# Altium project Elkapod_power_supply_controller_module.PrjPcb (part 4 of 5)
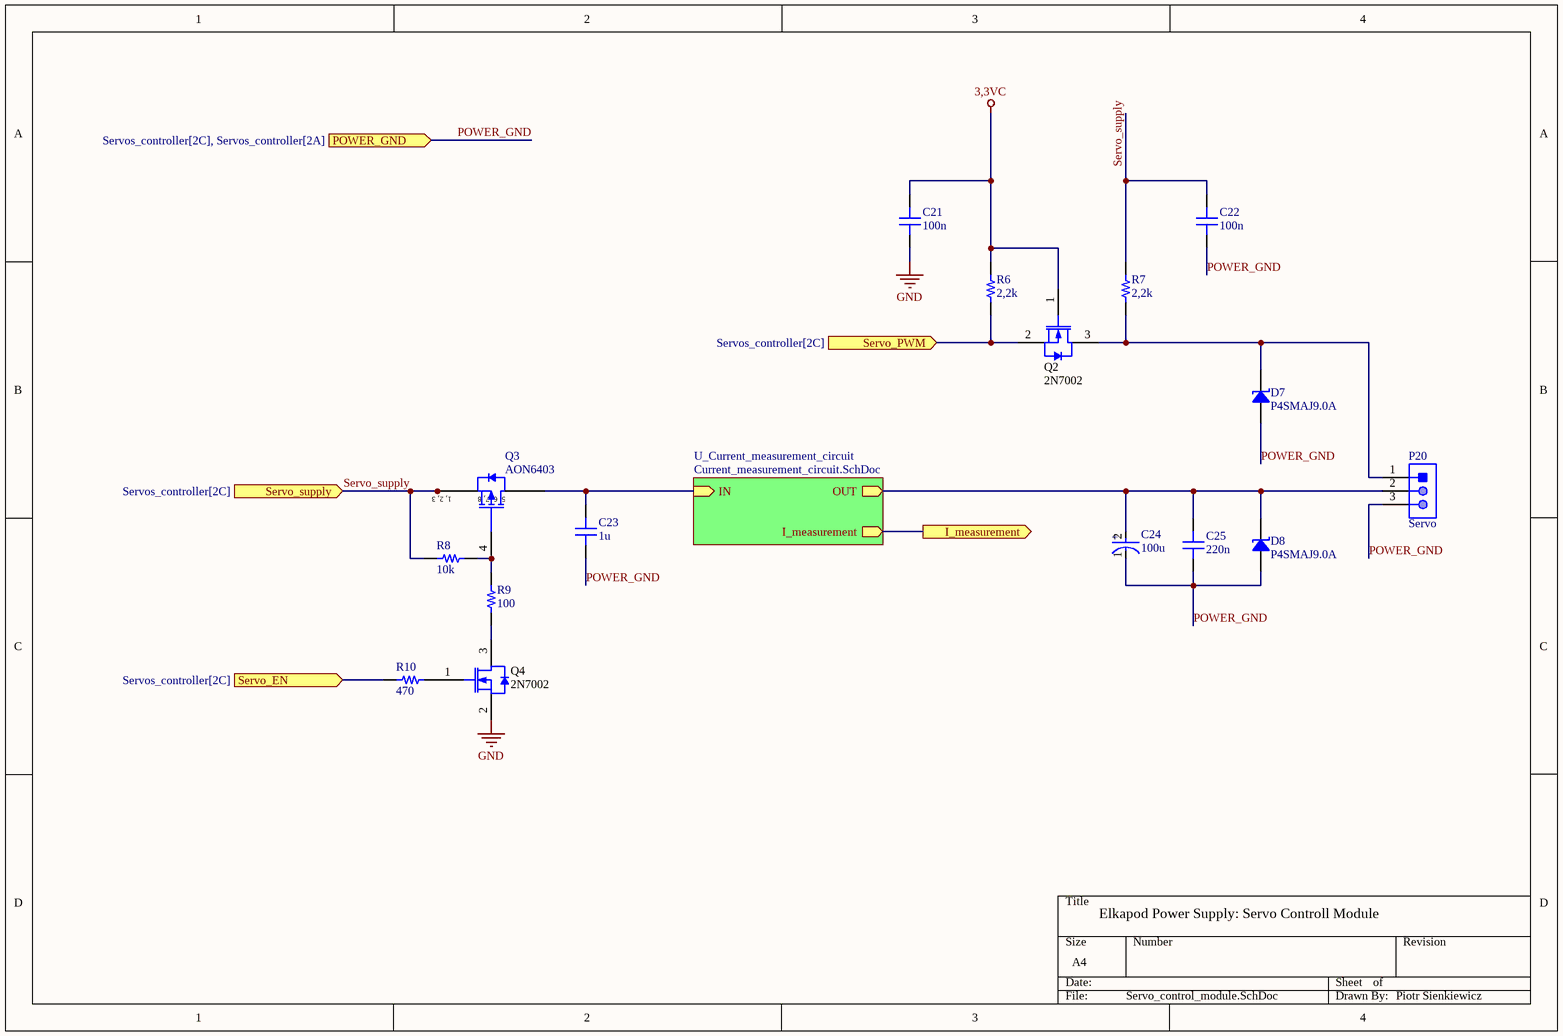
[diagram p8: Servo_control_module.SchDoc]
## Nets that join several sheets
3,3V_STANDBY: Elkapod_power_supply_controller_module (11 pins), Logic_controller (44 pins)
3,3VC: Elkapod_power_supply_controller_module (C17.2 C18.2 C19.2 Q1.5), U_Current_measurement_circuit (C66_U_Current_measurement_circuit#1.2 U8_U_Current_measurement_circuit#1.3), U_Current_measurement_circuit (C66_U_Current_measurement_circuit#2.2 U8_U_Current_measurement_circuit#2.3), U_Current_measurement_circuit (C66_U_Current_measurement_circuit#3.2 U8_U_Current_measurement_circuit#3.3), U_Current_measurement_circuit (C66_U_Current_measurement_circuit#4.2 U8_U_Current_measurement_circuit#4.3), Logic_controller (12 pins), U_Servos_controller/U_Servo_control_module (C21_U_Servos_controller_U_Servo_control_module#1.2 Q2_U_Servos_controller_U_Servo_control_module#1.1 R6_U_Servos_controller_U_Servo_control_module#1.2), U_Servos_controller/U_Servo_control_module/U_Current_measurement_circuit (C66_U_Servos_controller_U_Servo_control_module_U_Current_measurement_circuit#1.2 U8_U_Servos_controller_U_Servo_control_module_U_Current_measurement_circuit#1.3), U_Servos_controller/U_Servo_control_module (C21_U_Servos_controller_U_Servo_control_module#2.2 Q2_U_Servos_controller_U_Servo_control_module#2.1 R6_U_Servos_controller_U_Servo_control_module#2.2), U_Servos_controller/U_Servo_control_module/U_Current_measurement_circuit (C66_U_Servos_controller_U_Servo_control_module_U_Current_measurement_circuit#2.2 U8_U_Servos_controller_U_Servo_control_module_U_Current_measurement_circuit#2.3), U_Servos_controller/U_Servo_control_module (C21_U_Servos_controller_U_Servo_control_module#3.2 Q2_U_Servos_controller_U_Servo_control_module#3.1 R6_U_Servos_controller_U_Servo_control_module#3.2), U_Servos_controller/U_Servo_control_module/U_Current_measurement_circuit (C66_U_Servos_controller_U_Servo_control_module_U_Current_measurement_circuit#3.2 U8_U_Servos_controller_U_Servo_control_module_U_Current_measurement_circuit#3.3), U_Servos_controller/U_Servo_control_module (C21_U_Servos_controller_U_Servo_control_module#4.2 Q2_U_Servos_controller_U_Servo_control_module#4.1 R6_U_Servos_controller_U_Servo_control_module#4.2), U_Servos_controller/U_Servo_control_module/U_Current_measurement_circuit (C66_U_Servos_controller_U_Servo_control_module_U_Current_measurement_circuit#4.2 U8_U_Servos_controller_U_Servo_control_module_U_Current_measurement_circuit#4.3), U_Servos_controller/U_Servo_control_module (C21_U_Servos_controller_U_Servo_control_module#5.2 Q2_U_Servos_controller_U_Servo_control_module#5.1 R6_U_Servos_controller_U_Servo_control_module#5.2), U_Servos_controller/U_Servo_control_module/U_Current_measurement_circuit (C66_U_Servos_controller_U_Servo_control_module_U_Current_measurement_circuit#5.2 U8_U_Servos_controller_U_Servo_control_module_U_Current_measurement_circuit#5.3), U_Servos_controller/U_Servo_control_module (C21_U_Servos_controller_U_Servo_control_module#6.2 Q2_U_Servos_controller_U_Servo_control_module#6.1 R6_U_Servos_controller_U_Servo_control_module#6.2), U_Servos_controller/U_Servo_control_module/U_Current_measurement_circuit (C66_U_Servos_controller_U_Servo_control_module_U_Current_measurement_circuit#6.2 U8_U_Servos_controller_U_Servo_control_module_U_Current_measurement_circuit#6.3), U_Servos_controller/U_Servo_control_module (C21_U_Servos_controller_U_Servo_control_module#7.2 Q2_U_Servos_controller_U_Servo_control_module#7.1 R6_U_Servos_controller_U_Servo_control_module#7.2), U_Servos_controller/U_Servo_control_module/U_Current_measurement_circuit (C66_U_Servos_controller_U_Servo_control_module_U_Current_measurement_circuit#7.2 U8_U_Servos_controller_U_Servo_control_module_U_Current_measurement_circuit#7.3), U_Servos_controller/U_Servo_control_module (C21_U_Servos_controller_U_Servo_control_module#8.2 Q2_U_Servos_controller_U_Servo_control_module#8.1 R6_U_Servos_controller_U_Servo_control_module#8.2), U_Servos_controller/U_Servo_control_module/U_Current_measurement_circuit (C66_U_Servos_controller_U_Servo_control_module_U_Current_measurement_circuit#8.2 U8_U_Servos_controller_U_Servo_control_module_U_Current_measurement_circuit#8.3), U_Servos_controller/U_Servo_control_module (C21_U_Servos_controller_U_Servo_control_module#9.2 Q2_U_Servos_controller_U_Servo_control_module#9.1 R6_U_Servos_controller_U_Servo_control_module#9.2), U_Servos_controller/U_Servo_control_module/U_Current_measurement_circuit (C66_U_Servos_controller_U_Servo_control_module_U_Current_measurement_circuit#9.2 U8_U_Servos_controller_U_Servo_control_module_U_Current_measurement_circuit#9.3), U_Servos_controller/U_Servo_control_module (C21_U_Servos_controller_U_Servo_control_module#10.2 Q2_U_Servos_controller_U_Servo_control_module#10.1 R6_U_Servos_controller_U_Servo_control_module#10.2), U_Servos_controller/U_Servo_control_module/U_Current_measurement_circuit (C66_U_Servos_controller_U_Servo_control_module_U_Current_measurement_circuit#10.2 U8_U_Servos_controller_U_Servo_control_module_U_Current_measurement_circuit#10.3), U_Servos_controller/U_Servo_control_module (C21_U_Servos_controller_U_Servo_control_module#11.2 Q2_U_Servos_controller_U_Servo_control_module#11.1 R6_U_Servos_controller_U_Servo_control_module#11.2), U_Servos_controller/U_Servo_control_module/U_Current_measurement_circuit (C66_U_Servos_controller_U_Servo_control_module_U_Current_measurement_circuit#11.2 U8_U_Servos_controller_U_Servo_control_module_U_Current_measurement_circuit#11.3), U_Servos_controller/U_Servo_control_module (C21_U_Servos_controller_U_Servo_control_module#12.2 Q2_U_Servos_controller_U_Servo_control_module#12.1 R6_U_Servos_controller_U_Servo_control_module#12.2), U_Servos_controller/U_Servo_control_module/U_Current_measurement_circuit (C66_U_Servos_controller_U_Servo_control_module_U_Current_measurement_circuit#12.2 U8_U_Servos_controller_U_Servo_control_module_U_Current_measurement_circuit#12.3), U_Servos_controller/U_Servo_control_module (C21_U_Servos_controller_U_Servo_control_module#13.2 Q2_U_Servos_controller_U_Servo_control_module#13.1 R6_U_Servos_controller_U_Servo_control_module#13.2), U_Servos_controller/U_Servo_control_module/U_Current_measurement_circuit (C66_U_Servos_controller_U_Servo_control_module_U_Current_measurement_circuit#13.2 U8_U_Servos_controller_U_Servo_control_module_U_Current_measurement_circuit#13.3), U_Servos_controller/U_Servo_control_module (C21_U_Servos_controller_U_Servo_control_module#14.2 Q2_U_Servos_controller_U_Servo_control_module#14.1 R6_U_Servos_controller_U_Servo_control_module#14.2), U_Servos_controller/U_Servo_control_module/U_Current_measurement_circuit (C66_U_Servos_controller_U_Servo_control_module_U_Current_measurement_circuit#14.2 U8_U_Servos_controller_U_Servo_control_module_U_Current_measurement_circuit#14.3), U_Servos_controller/U_Servo_control_module (C21_U_Servos_controller_U_Servo_control_module#15.2 Q2_U_Servos_controller_U_Servo_control_module#15.1 R6_U_Servos_controller_U_Servo_control_module#15.2), U_Servos_controller/U_Servo_control_module/U_Current_measurement_circuit (C66_U_Servos_controller_U_Servo_control_module_U_Current_measurement_circuit#15.2 U8_U_Servos_controller_U_Servo_control_module_U_Current_measurement_circuit#15.3), U_Servos_controller/U_Servo_control_module (C21_U_Servos_controller_U_Servo_control_module#16.2 Q2_U_Servos_controller_U_Servo_control_module#16.1 R6_U_Servos_controller_U_Servo_control_module#16.2), U_Servos_controller/U_Servo_control_module/U_Current_measurement_circuit (C66_U_Servos_controller_U_Servo_control_module_U_Current_measurement_circuit#16.2 U8_U_Servos_controller_U_Servo_control_module_U_Current_measurement_circuit#16.3), U_Servos_controller/U_Servo_control_module (C21_U_Servos_controller_U_Servo_control_module#17.2 Q2_U_Servos_controller_U_Servo_control_module#17.1 R6_U_Servos_controller_U_Servo_control_module#17.2), U_Servos_controller/U_Servo_control_module/U_Current_measurement_circuit (C66_U_Servos_controller_U_Servo_control_module_U_Current_measurement_circuit#17.2 U8_U_Servos_controller_U_Servo_control_module_U_Current_measurement_circuit#17.3), U_Servos_controller/U_Servo_control_module (C21_U_Servos_controller_U_Servo_control_module#18.2 Q2_U_Servos_controller_U_Servo_control_module#18.1 R6_U_Servos_controller_U_Servo_control_module#18.2), U_Servos_controller/U_Servo_control_module/U_Current_measurement_circuit (C66_U_Servos_controller_U_Servo_control_module_U_Current_measurement_circuit#18.2 U8_U_Servos_controller_U_Servo_control_module_U_Current_measurement_circuit#18.3)
5V_STANDBY: Elkapod_power_supply_controller_module (5 pins), U_Current_measurement_circuit (R80_U_Current_measurement_circuit#4.1 U8_U_Current_measurement_circuit#4.5), Logic_controller (FB2.1 IC1.2 R28.1)
AGND: Elkapod_power_supply_controller_module (R1.1), U_Current_measurement_circuit (C65_U_Current_measurement_circuit#1.1 C66_U_Current_measurement_circuit#1.1 U8_U_Current_measurement_circuit#1.1 U8_U_Current_measurement_circuit#1.2), U_Current_measurement_circuit (C65_U_Current_measurement_circuit#2.1 C66_U_Current_measurement_circuit#2.1 U8_U_Current_measurement_circuit#2.1 U8_U_Current_measurement_circuit#2.2), U_Current_measurement_circuit (C65_U_Current_measurement_circuit#3.1 C66_U_Current_measurement_circuit#3.1 U8_U_Current_measurement_circuit#3.1 U8_U_Current_measurement_circuit#3.2), U_Current_measurement_circuit (C65_U_Current_measurement_circuit#4.1 C66_U_Current_measurement_circuit#4.1 U8_U_Current_measurement_circuit#4.1 U8_U_Current_measurement_circuit#4.2), Logic_controller (6 pins), U_Servos_controller/U_Servo_control_module/U_Current_measurement_circuit (C65_U_Servos_controller_U_Servo_control_module_U_Current_measurement_circuit#1.1 C66_U_Servos_controller_U_Servo_control_module_U_Current_measurement_circuit#1.1 U8_U_Servos_controller_U_Servo_control_module_U_Current_measurement_circuit#1.1 U8_U_Servos_controller_U_Servo_control_module_U_Current_measurement_circuit#1.2), U_Servos_controller/U_Servo_control_module/U_Current_measurement_circuit (C65_U_Servos_controller_U_Servo_control_module_U_Current_measurement_circuit#2.1 C66_U_Servos_controller_U_Servo_control_module_U_Current_measurement_circuit#2.1 U8_U_Servos_controller_U_Servo_control_module_U_Current_measurement_circuit#2.1 U8_U_Servos_controller_U_Servo_control_module_U_Current_measurement_circuit#2.2), U_Servos_controller/U_Servo_control_module/U_Current_measurement_circuit (C65_U_Servos_controller_U_Servo_control_module_U_Current_measurement_circuit#3.1 C66_U_Servos_controller_U_Servo_control_module_U_Current_measurement_circuit#3.1 U8_U_Servos_controller_U_Servo_control_module_U_Current_measurement_circuit#3.1 U8_U_Servos_controller_U_Servo_control_module_U_Current_measurement_circuit#3.2), U_Servos_controller/U_Servo_control_module/U_Current_measurement_circuit (C65_U_Servos_controller_U_Servo_control_module_U_Current_measurement_circuit#4.1 C66_U_Servos_controller_U_Servo_control_module_U_Current_measurement_circuit#4.1 U8_U_Servos_controller_U_Servo_control_module_U_Current_measurement_circuit#4.1 U8_U_Servos_controller_U_Servo_control_module_U_Current_measurement_circuit#4.2), U_Servos_controller/U_Servo_control_module/U_Current_measurement_circuit (C65_U_Servos_controller_U_Servo_control_module_U_Current_measurement_circuit#5.1 C66_U_Servos_controller_U_Servo_control_module_U_Current_measurement_circuit#5.1 U8_U_Servos_controller_U_Servo_control_module_U_Current_measurement_circuit#5.1 U8_U_Servos_controller_U_Servo_control_module_U_Current_measurement_circuit#5.2), U_Servos_controller/U_Servo_control_module/U_Current_measurement_circuit (C65_U_Servos_controller_U_Servo_control_module_U_Current_measurement_circuit#6.1 C66_U_Servos_controller_U_Servo_control_module_U_Current_measurement_circuit#6.1 U8_U_Servos_controller_U_Servo_control_module_U_Current_measurement_circuit#6.1 U8_U_Servos_controller_U_Servo_control_module_U_Current_measurement_circuit#6.2), U_Servos_controller/U_Servo_control_module/U_Current_measurement_circuit (C65_U_Servos_controller_U_Servo_control_module_U_Current_measurement_circuit#7.1 C66_U_Servos_controller_U_Servo_control_module_U_Current_measurement_circuit#7.1 U8_U_Servos_controller_U_Servo_control_module_U_Current_measurement_circuit#7.1 U8_U_Servos_controller_U_Servo_control_module_U_Current_measurement_circuit#7.2), U_Servos_controller/U_Servo_control_module/U_Current_measurement_circuit (C65_U_Servos_controller_U_Servo_control_module_U_Current_measurement_circuit#8.1 C66_U_Servos_controller_U_Servo_control_module_U_Current_measurement_circuit#8.1 U8_U_Servos_controller_U_Servo_control_module_U_Current_measurement_circuit#8.1 U8_U_Servos_controller_U_Servo_control_module_U_Current_measurement_circuit#8.2), U_Servos_controller/U_Servo_control_module/U_Current_measurement_circuit (C65_U_Servos_controller_U_Servo_control_module_U_Current_measurement_circuit#9.1 C66_U_Servos_controller_U_Servo_control_module_U_Current_measurement_circuit#9.1 U8_U_Servos_controller_U_Servo_control_module_U_Current_measurement_circuit#9.1 U8_U_Servos_controller_U_Servo_control_module_U_Current_measurement_circuit#9.2), U_Servos_controller/U_Servo_control_module/U_Current_measurement_circuit (C65_U_Servos_controller_U_Servo_control_module_U_Current_measurement_circuit#10.1 C66_U_Servos_controller_U_Servo_control_module_U_Current_measurement_circuit#10.1 U8_U_Servos_controller_U_Servo_control_module_U_Current_measurement_circuit#10.1 U8_U_Servos_controller_U_Servo_control_module_U_Current_measurement_circuit#10.2), U_Servos_controller/U_Servo_control_module/U_Current_measurement_circuit (C65_U_Servos_controller_U_Servo_control_module_U_Current_measurement_circuit#11.1 C66_U_Servos_controller_U_Servo_control_module_U_Current_measurement_circuit#11.1 U8_U_Servos_controller_U_Servo_control_module_U_Current_measurement_circuit#11.1 U8_U_Servos_controller_U_Servo_control_module_U_Current_measurement_circuit#11.2), U_Servos_controller/U_Servo_control_module/U_Current_measurement_circuit (C65_U_Servos_controller_U_Servo_control_module_U_Current_measurement_circuit#12.1 C66_U_Servos_controller_U_Servo_control_module_U_Current_measurement_circuit#12.1 U8_U_Servos_controller_U_Servo_control_module_U_Current_measurement_circuit#12.1 U8_U_Servos_controller_U_Servo_control_module_U_Current_measurement_circuit#12.2), U_Servos_controller/U_Servo_control_module/U_Current_measurement_circuit (C65_U_Servos_controller_U_Servo_control_module_U_Current_measurement_circuit#13.1 C66_U_Servos_controller_U_Servo_control_module_U_Current_measurement_circuit#13.1 U8_U_Servos_controller_U_Servo_control_module_U_Current_measurement_circuit#13.1 U8_U_Servos_controller_U_Servo_control_module_U_Current_measurement_circuit#13.2), U_Servos_controller/U_Servo_control_module/U_Current_measurement_circuit (C65_U_Servos_controller_U_Servo_control_module_U_Current_measurement_circuit#14.1 C66_U_Servos_controller_U_Servo_control_module_U_Current_measurement_circuit#14.1 U8_U_Servos_controller_U_Servo_control_module_U_Current_measurement_circuit#14.1 U8_U_Servos_controller_U_Servo_control_module_U_Current_measurement_circuit#14.2), U_Servos_controller/U_Servo_control_module/U_Current_measurement_circuit (C65_U_Servos_controller_U_Servo_control_module_U_Current_measurement_circuit#15.1 C66_U_Servos_controller_U_Servo_control_module_U_Current_measurement_circuit#15.1 U8_U_Servos_controller_U_Servo_control_module_U_Current_measurement_circuit#15.1 U8_U_Servos_controller_U_Servo_control_module_U_Current_measurement_circuit#15.2), U_Servos_controller/U_Servo_control_module/U_Current_measurement_circuit (C65_U_Servos_controller_U_Servo_control_module_U_Current_measurement_circuit#16.1 C66_U_Servos_controller_U_Servo_control_module_U_Current_measurement_circuit#16.1 U8_U_Servos_controller_U_Servo_control_module_U_Current_measurement_circuit#16.1 U8_U_Servos_controller_U_Servo_control_module_U_Current_measurement_circuit#16.2), U_Servos_controller/U_Servo_control_module/U_Current_measurement_circuit (C65_U_Servos_controller_U_Servo_control_module_U_Current_measurement_circuit#17.1 C66_U_Servos_controller_U_Servo_control_module_U_Current_measurement_circuit#17.1 U8_U_Servos_controller_U_Servo_control_module_U_Current_measurement_circuit#17.1 U8_U_Servos_controller_U_Servo_control_module_U_Current_measurement_circuit#17.2), U_Servos_controller/U_Servo_control_module/U_Current_measurement_circuit (C65_U_Servos_controller_U_Servo_control_module_U_Current_measurement_circuit#18.1 C66_U_Servos_controller_U_Servo_control_module_U_Current_measurement_circuit#18.1 U8_U_Servos_controller_U_Servo_control_module_U_Current_measurement_circuit#18.1 U8_U_Servos_controller_U_Servo_control_module_U_Current_measurement_circuit#18.2)
GND: Elkapod_power_supply_controller_module (24 pins), Controllable_voltage_outputs (R60.2), Logic_controller (89 pins), U_Servos_controller (R11_U_Servos_controller#1.1), U_Servos_controller/U_Servo_control_module (C21_U_Servos_controller_U_Servo_control_module#1.1 Q4_U_Servos_controller_U_Servo_control_module#1.2), U_Servos_controller/U_Servo_control_module (C21_U_Servos_controller_U_Servo_control_module#2.1 Q4_U_Servos_controller_U_Servo_control_module#2.2), U_Servos_controller/U_Servo_control_module (C21_U_Servos_controller_U_Servo_control_module#3.1 Q4_U_Servos_controller_U_Servo_control_module#3.2), U_Servos_controller/U_Servo_control_module (C21_U_Servos_controller_U_Servo_control_module#4.1 Q4_U_Servos_controller_U_Servo_control_module#4.2), U_Servos_controller/U_Servo_control_module (C21_U_Servos_controller_U_Servo_control_module#5.1 Q4_U_Servos_controller_U_Servo_control_module#5.2), U_Servos_controller/U_Servo_control_module (C21_U_Servos_controller_U_Servo_control_module#6.1 Q4_U_Servos_controller_U_Servo_control_module#6.2), U_Servos_controller (R11_U_Servos_controller#2.1), U_Servos_controller/U_Servo_control_module (C21_U_Servos_controller_U_Servo_control_module#7.1 Q4_U_Servos_controller_U_Servo_control_module#7.2), U_Servos_controller/U_Servo_control_module (C21_U_Servos_controller_U_Servo_control_module#8.1 Q4_U_Servos_controller_U_Servo_control_module#8.2), U_Servos_controller/U_Servo_control_module (C21_U_Servos_controller_U_Servo_control_module#9.1 Q4_U_Servos_controller_U_Servo_control_module#9.2), U_Servos_controller/U_Servo_control_module (C21_U_Servos_controller_U_Servo_control_module#10.1 Q4_U_Servos_controller_U_Servo_control_module#10.2), U_Servos_controller/U_Servo_control_module (C21_U_Servos_controller_U_Servo_control_module#11.1 Q4_U_Servos_controller_U_Servo_control_module#11.2), U_Servos_controller/U_Servo_control_module (C21_U_Servos_controller_U_Servo_control_module#12.1 Q4_U_Servos_controller_U_Servo_control_module#12.2), U_Servos_controller (R11_U_Servos_controller#3.1), U_Servos_controller/U_Servo_control_module (C21_U_Servos_controller_U_Servo_control_module#13.1 Q4_U_Servos_controller_U_Servo_control_module#13.2), U_Servos_controller/U_Servo_control_module (C21_U_Servos_controller_U_Servo_control_module#14.1 Q4_U_Servos_controller_U_Servo_control_module#14.2), U_Servos_controller/U_Servo_control_module (C21_U_Servos_controller_U_Servo_control_module#15.1 Q4_U_Servos_controller_U_Servo_control_module#15.2), U_Servos_controller/U_Servo_control_module (C21_U_Servos_controller_U_Servo_control_module#16.1 Q4_U_Servos_controller_U_Servo_control_module#16.2), U_Servos_controller/U_Servo_control_module (C21_U_Servos_controller_U_Servo_control_module#17.1 Q4_U_Servos_controller_U_Servo_control_module#17.2), U_Servos_controller/U_Servo_control_module (C21_U_Servos_controller_U_Servo_control_module#18.1 Q4_U_Servos_controller_U_Servo_control_module#18.2)
GND_3V3_2: Elkapod_power_supply_controller_module (P18.2), Controllable_voltage_outputs (10 pins)
GND_5V: Elkapod_power_supply_controller_module (16 pins), Controllable_voltage_outputs (17 pins)
POWER_GND: Elkapod_power_supply_controller_module (P19.2), U_Servos_controller (R11_U_Servos_controller#1.2), U_Servos_controller/U_Servo_control_module (7 pins), U_Servos_controller/U_Servo_control_module (7 pins), U_Servos_controller/U_Servo_control_module (7 pins), U_Servos_controller/U_Servo_control_module (7 pins), U_Servos_controller/U_Servo_control_module (7 pins), U_Servos_controller/U_Servo_control_module (7 pins)
POWER_GND: Elkapod_power_supply_controller_module (P16.2), U_Servos_controller (R11_U_Servos_controller#2.2), U_Servos_controller/U_Servo_control_module (7 pins), U_Servos_controller/U_Servo_control_module (7 pins), U_Servos_controller/U_Servo_control_module (7 pins), U_Servos_controller/U_Servo_control_module (7 pins), U_Servos_controller/U_Servo_control_module (7 pins), U_Servos_controller/U_Servo_control_module (7 pins)
POWER_GND: Elkapod_power_supply_controller_module (P17.2), U_Servos_controller (R11_U_Servos_controller#3.2), U_Servos_controller/U_Servo_control_module (7 pins), U_Servos_controller/U_Servo_control_module (7 pins), U_Servos_controller/U_Servo_control_module (7 pins), U_Servos_controller/U_Servo_control_module (7 pins), U_Servos_controller/U_Servo_control_module (7 pins), U_Servos_controller/U_Servo_control_module (7 pins)
3,3V: Elkapod_power_supply_controller_module (P18.1), Controllable_voltage_outputs (12 pins)
5V: Elkapod_power_supply_controller_module (C14.2 P6.1 P12.1), U_Current_measurement_circuit (R80_U_Current_measurement_circuit#3.2 U8_U_Current_measurement_circuit#3.4), Controllable_voltage_outputs (12 pins)
5V_POWER_OUT: Elkapod_power_supply_controller_module (5 pins), U_Current_measurement_circuit (R80_U_Current_measurement_circuit#3.1 U8_U_Current_measurement_circuit#3.5)
5V_STANDBY_IN: Elkapod_power_supply_controller_module (CN1.1 CN1.2 CN1.3 CN1.4), U_Current_measurement_circuit (R80_U_Current_measurement_circuit#4.2 U8_U_Current_measurement_circuit#4.4)
I_3V3_POW_SENSE: U_Current_measurement_circuit (C65_U_Current_measurement_circuit#2.2 R81_U_Current_measurement_circuit#2.2), Logic_controller (U3.18)
I_5V_POW_SENSE: U_Current_measurement_circuit (C65_U_Current_measurement_circuit#3.2 R81_U_Current_measurement_circuit#3.2), Logic_controller (U3.15)
I_MANIP_SENSE: U_Current_measurement_circuit (C65_U_Current_measurement_circuit#1.2 R81_U_Current_measurement_circuit#1.2), Logic_controller (U3.14)
I_SERVO1: Logic_controller (U3.21), U_Servos_controller/U_Servo_control_module/U_Current_measurement_circuit (C65_U_Servos_controller_U_Servo_control_module_U_Current_measurement_circuit#7.2 R81_U_Servos_controller_U_Servo_control_module_U_Current_measurement_circuit#7.2)
I_SERVO2: Logic_controller (U3.22), U_Servos_controller/U_Servo_control_module/U_Current_measurement_circuit (C65_U_Servos_controller_U_Servo_control_module_U_Current_measurement_circuit#8.2 R81_U_Servos_controller_U_Servo_control_module_U_Current_measurement_circuit#8.2)
I_SERVO3: Logic_controller (U3.26), U_Servos_controller/U_Servo_control_module/U_Current_measurement_circuit (C65_U_Servos_controller_U_Servo_control_module_U_Current_measurement_circuit#9.2 R81_U_Servos_controller_U_Servo_control_module_U_Current_measurement_circuit#9.2)
I_SERVO4: Logic_controller (U3.27), U_Servos_controller/U_Servo_control_module/U_Current_measurement_circuit (C65_U_Servos_controller_U_Servo_control_module_U_Current_measurement_circuit#10.2 R81_U_Servos_controller_U_Servo_control_module_U_Current_measurement_circuit#10.2)
I_SERVO5: Logic_controller (U3.28), U_Servos_controller/U_Servo_control_module/U_Current_measurement_circuit (C65_U_Servos_controller_U_Servo_control_module_U_Current_measurement_circuit#11.2 R81_U_Servos_controller_U_Servo_control_module_U_Current_measurement_circuit#11.2)
I_SERVO6: Logic_controller (U3.29), U_Servos_controller/U_Servo_control_module/U_Current_measurement_circuit (C65_U_Servos_controller_U_Servo_control_module_U_Current_measurement_circuit#12.2 R81_U_Servos_controller_U_Servo_control_module_U_Current_measurement_circuit#12.2)
I_SERVO7: Logic_controller (U3.34), U_Servos_controller/U_Servo_control_module/U_Current_measurement_circuit (C65_U_Servos_controller_U_Servo_control_module_U_Current_measurement_circuit#13.2 R81_U_Servos_controller_U_Servo_control_module_U_Current_measurement_circuit#13.2)
I_SERVO8: Logic_controller (U3.35), U_Servos_controller/U_Servo_control_module/U_Current_measurement_circuit (C65_U_Servos_controller_U_Servo_control_module_U_Current_measurement_circuit#14.2 R81_U_Servos_controller_U_Servo_control_module_U_Current_measurement_circuit#14.2)
I_SERVO9: Logic_controller (U3.36), U_Servos_controller/U_Servo_control_module/U_Current_measurement_circuit (C65_U_Servos_controller_U_Servo_control_module_U_Current_measurement_circuit#15.2 R81_U_Servos_controller_U_Servo_control_module_U_Current_measurement_circuit#15.2)
I_SERVO10: Logic_controller (U3.37), U_Servos_controller/U_Servo_control_module/U_Current_measurement_circuit (C65_U_Servos_controller_U_Servo_control_module_U_Current_measurement_circuit#16.2 R81_U_Servos_controller_U_Servo_control_module_U_Current_measurement_circuit#16.2)
I_SERVO11: Logic_controller (U3.40), U_Servos_controller/U_Servo_control_module/U_Current_measurement_circuit (C65_U_Servos_controller_U_Servo_control_module_U_Current_measurement_circuit#17.2 R81_U_Servos_controller_U_Servo_control_module_U_Current_measurement_circuit#17.2)
I_SERVO12: Logic_controller (U3.41), U_Servos_controller/U_Servo_control_module/U_Current_measurement_circuit (C65_U_Servos_controller_U_Servo_control_module_U_Current_measurement_circuit#18.2 R81_U_Servos_controller_U_Servo_control_module_U_Current_measurement_circuit#18.2)
I_SERVO13: Logic_controller (U3.42), U_Servos_controller/U_Servo_control_module/U_Current_measurement_circuit (C65_U_Servos_controller_U_Servo_control_module_U_Current_measurement_circuit#1.2 R81_U_Servos_controller_U_Servo_control_module_U_Current_measurement_circuit#1.2)
I_SERVO14: Logic_controller (U3.43), U_Servos_controller/U_Servo_control_module/U_Current_measurement_circuit (C65_U_Servos_controller_U_Servo_control_module_U_Current_measurement_circuit#2.2 R81_U_Servos_controller_U_Servo_control_module_U_Current_measurement_circuit#2.2)
I_SERVO15: Logic_controller (U3.44), U_Servos_controller/U_Servo_control_module/U_Current_measurement_circuit (C65_U_Servos_controller_U_Servo_control_module_U_Current_measurement_circuit#3.2 R81_U_Servos_controller_U_Servo_control_module_U_Current_measurement_circuit#3.2)
I_SERVO16: Logic_controller (U3.45), U_Servos_controller/U_Servo_control_module/U_Current_measurement_circuit (C65_U_Servos_controller_U_Servo_control_module_U_Current_measurement_circuit#4.2 R81_U_Servos_controller_U_Servo_control_module_U_Current_measurement_circuit#4.2)
I_SERVO17: Logic_controller (U3.46), U_Servos_controller/U_Servo_control_module/U_Current_measurement_circuit (C65_U_Servos_controller_U_Servo_control_module_U_Current_measurement_circuit#5.2 R81_U_Servos_controller_U_Servo_control_module_U_Current_measurement_circuit#5.2)
I_SERVO18: Logic_controller (U3.47), U_Servos_controller/U_Servo_control_module/U_Current_measurement_circuit (C65_U_Servos_controller_U_Servo_control_module_U_Current_measurement_circuit#6.2 R81_U_Servos_controller_U_Servo_control_module_U_Current_measurement_circuit#6.2)
I_STANDBY_SENSE: U_Current_measurement_circuit (C65_U_Current_measurement_circuit#4.2 R81_U_Current_measurement_circuit#4.2), Logic_controller (U3.20)
MISO: Elkapod_power_supply_controller_module (CN1.16), Logic_controller (U3.112)
MOSI: Elkapod_power_supply_controller_module (CN1.18), Logic_controller (U3.113)
NetC1_2: Elkapod_power_supply_controller_module (C1.2 C2.1 D2.2 P5.1), U_Current_measurement_circuit (R80_U_Current_measurement_circuit#2.1 U8_U_Current_measurement_circuit#2.5)
NetC15_2: Elkapod_power_supply_controller_module (C15.2 C16.1 D6.2 P14.1), U_Current_measurement_circuit (R80_U_Current_measurement_circuit#1.1 U8_U_Current_measurement_circuit#1.5)
NetC23_U_Servos_controller_U_Servo_control_module#1_2: U_Servos_controller/U_Servo_control_module (C23_U_Servos_controller_U_Servo_control_module#1.2 Q3_U_Servos_controller_U_Servo_control_module#1.5), U_Servos_controller/U_Servo_control_module/U_Current_measurement_circuit (R80_U_Servos_controller_U_Servo_control_module_U_Current_measurement_circuit#1.2 U8_U_Servos_controller_U_Servo_control_module_U_Current_measurement_circuit#1.4)
NetC23_U_Servos_controller_U_Servo_control_module#2_2: U_Servos_controller/U_Servo_control_module (C23_U_Servos_controller_U_Servo_control_module#2.2 Q3_U_Servos_controller_U_Servo_control_module#2.5), U_Servos_controller/U_Servo_control_module/U_Current_measurement_circuit (R80_U_Servos_controller_U_Servo_control_module_U_Current_measurement_circuit#2.2 U8_U_Servos_controller_U_Servo_control_module_U_Current_measurement_circuit#2.4)
NetC23_U_Servos_controller_U_Servo_control_module#3_2: U_Servos_controller/U_Servo_control_module (C23_U_Servos_controller_U_Servo_control_module#3.2 Q3_U_Servos_controller_U_Servo_control_module#3.5), U_Servos_controller/U_Servo_control_module/U_Current_measurement_circuit (R80_U_Servos_controller_U_Servo_control_module_U_Current_measurement_circuit#3.2 U8_U_Servos_controller_U_Servo_control_module_U_Current_measurement_circuit#3.4)
NetC23_U_Servos_controller_U_Servo_control_module#4_2: U_Servos_controller/U_Servo_control_module (C23_U_Servos_controller_U_Servo_control_module#4.2 Q3_U_Servos_controller_U_Servo_control_module#4.5), U_Servos_controller/U_Servo_control_module/U_Current_measurement_circuit (R80_U_Servos_controller_U_Servo_control_module_U_Current_measurement_circuit#4.2 U8_U_Servos_controller_U_Servo_control_module_U_Current_measurement_circuit#4.4)
NetC23_U_Servos_controller_U_Servo_control_module#5_2: U_Servos_controller/U_Servo_control_module (C23_U_Servos_controller_U_Servo_control_module#5.2 Q3_U_Servos_controller_U_Servo_control_module#5.5), U_Servos_controller/U_Servo_control_module/U_Current_measurement_circuit (R80_U_Servos_controller_U_Servo_control_module_U_Current_measurement_circuit#5.2 U8_U_Servos_controller_U_Servo_control_module_U_Current_measurement_circuit#5.4)
NetC23_U_Servos_controller_U_Servo_control_module#6_2: U_Servos_controller/U_Servo_control_module (C23_U_Servos_controller_U_Servo_control_module#6.2 Q3_U_Servos_controller_U_Servo_control_module#6.5), U_Servos_controller/U_Servo_control_module/U_Current_measurement_circuit (R80_U_Servos_controller_U_Servo_control_module_U_Current_measurement_circuit#6.2 U8_U_Servos_controller_U_Servo_control_module_U_Current_measurement_circuit#6.4)
NetC23_U_Servos_controller_U_Servo_control_module#7_2: U_Servos_controller/U_Servo_control_module (C23_U_Servos_controller_U_Servo_control_module#7.2 Q3_U_Servos_controller_U_Servo_control_module#7.5), U_Servos_controller/U_Servo_control_module/U_Current_measurement_circuit (R80_U_Servos_controller_U_Servo_control_module_U_Current_measurement_circuit#7.2 U8_U_Servos_controller_U_Servo_control_module_U_Current_measurement_circuit#7.4)
NetC23_U_Servos_controller_U_Servo_control_module#8_2: U_Servos_controller/U_Servo_control_module (C23_U_Servos_controller_U_Servo_control_module#8.2 Q3_U_Servos_controller_U_Servo_control_module#8.5), U_Servos_controller/U_Servo_control_module/U_Current_measurement_circuit (R80_U_Servos_controller_U_Servo_control_module_U_Current_measurement_circuit#8.2 U8_U_Servos_controller_U_Servo_control_module_U_Current_measurement_circuit#8.4)
NetC23_U_Servos_controller_U_Servo_control_module#9_2: U_Servos_controller/U_Servo_control_module (C23_U_Servos_controller_U_Servo_control_module#9.2 Q3_U_Servos_controller_U_Servo_control_module#9.5), U_Servos_controller/U_Servo_control_module/U_Current_measurement_circuit (R80_U_Servos_controller_U_Servo_control_module_U_Current_measurement_circuit#9.2 U8_U_Servos_controller_U_Servo_control_module_U_Current_measurement_circuit#9.4)
NetC23_U_Servos_controller_U_Servo_control_module#10_2: U_Servos_controller/U_Servo_control_module (C23_U_Servos_controller_U_Servo_control_module#10.2 Q3_U_Servos_controller_U_Servo_control_module#10.5), U_Servos_controller/U_Servo_control_module/U_Current_measurement_circuit (R80_U_Servos_controller_U_Servo_control_module_U_Current_measurement_circuit#10.2 U8_U_Servos_controller_U_Servo_control_module_U_Current_measurement_circuit#10.4)
NetC23_U_Servos_controller_U_Servo_control_module#11_2: U_Servos_controller/U_Servo_control_module (C23_U_Servos_controller_U_Servo_control_module#11.2 Q3_U_Servos_controller_U_Servo_control_module#11.5), U_Servos_controller/U_Servo_control_module/U_Current_measurement_circuit (R80_U_Servos_controller_U_Servo_control_module_U_Current_measurement_circuit#11.2 U8_U_Servos_controller_U_Servo_control_module_U_Current_measurement_circuit#11.4)
NetC23_U_Servos_controller_U_Servo_control_module#12_2: U_Servos_controller/U_Servo_control_module (C23_U_Servos_controller_U_Servo_control_module#12.2 Q3_U_Servos_controller_U_Servo_control_module#12.5), U_Servos_controller/U_Servo_control_module/U_Current_measurement_circuit (R80_U_Servos_controller_U_Servo_control_module_U_Current_measurement_circuit#12.2 U8_U_Servos_controller_U_Servo_control_module_U_Current_measurement_circuit#12.4)
NetC23_U_Servos_controller_U_Servo_control_module#13_2: U_Servos_controller/U_Servo_control_module (C23_U_Servos_controller_U_Servo_control_module#13.2 Q3_U_Servos_controller_U_Servo_control_module#13.5), U_Servos_controller/U_Servo_control_module/U_Current_measurement_circuit (R80_U_Servos_controller_U_Servo_control_module_U_Current_measurement_circuit#13.2 U8_U_Servos_controller_U_Servo_control_module_U_Current_measurement_circuit#13.4)
NetC23_U_Servos_controller_U_Servo_control_module#14_2: U_Servos_controller/U_Servo_control_module (C23_U_Servos_controller_U_Servo_control_module#14.2 Q3_U_Servos_controller_U_Servo_control_module#14.5), U_Servos_controller/U_Servo_control_module/U_Current_measurement_circuit (R80_U_Servos_controller_U_Servo_control_module_U_Current_measurement_circuit#14.2 U8_U_Servos_controller_U_Servo_control_module_U_Current_measurement_circuit#14.4)
NetC23_U_Servos_controller_U_Servo_control_module#15_2: U_Servos_controller/U_Servo_control_module (C23_U_Servos_controller_U_Servo_control_module#15.2 Q3_U_Servos_controller_U_Servo_control_module#15.5), U_Servos_controller/U_Servo_control_module/U_Current_measurement_circuit (R80_U_Servos_controller_U_Servo_control_module_U_Current_measurement_circuit#15.2 U8_U_Servos_controller_U_Servo_control_module_U_Current_measurement_circuit#15.4)
NetC23_U_Servos_controller_U_Servo_control_module#16_2: U_Servos_controller/U_Servo_control_module (C23_U_Servos_controller_U_Servo_control_module#16.2 Q3_U_Servos_controller_U_Servo_control_module#16.5), U_Servos_controller/U_Servo_control_module/U_Current_measurement_circuit (R80_U_Servos_controller_U_Servo_control_module_U_Current_measurement_circuit#16.2 U8_U_Servos_controller_U_Servo_control_module_U_Current_measurement_circuit#16.4)
NetC23_U_Servos_controller_U_Servo_control_module#17_2: U_Servos_controller/U_Servo_control_module (C23_U_Servos_controller_U_Servo_control_module#17.2 Q3_U_Servos_controller_U_Servo_control_module#17.5), U_Servos_controller/U_Servo_control_module/U_Current_measurement_circuit (R80_U_Servos_controller_U_Servo_control_module_U_Current_measurement_circuit#17.2 U8_U_Servos_controller_U_Servo_control_module_U_Current_measurement_circuit#17.4)
NetC23_U_Servos_controller_U_Servo_control_module#18_2: U_Servos_controller/U_Servo_control_module (C23_U_Servos_controller_U_Servo_control_module#18.2 Q3_U_Servos_controller_U_Servo_control_module#18.5), U_Servos_controller/U_Servo_control_module/U_Current_measurement_circuit (R80_U_Servos_controller_U_Servo_control_module_U_Current_measurement_circuit#18.2 U8_U_Servos_controller_U_Servo_control_module_U_Current_measurement_circuit#18.4)
NetC24_U_Servos_controller_U_Servo_control_module#1_2: U_Servos_controller/U_Servo_control_module (C24_U_Servos_controller_U_Servo_control_module#1.2 C25_U_Servos_controller_U_Servo_control_module#1.1 D8_U_Servos_controller_U_Servo_control_module#1.2 P20_U_Servos_controller_U_Servo_control_module#1.2), U_Servos_controller/U_Servo_control_module/U_Current_measurement_circuit (R80_U_Servos_controller_U_Servo_control_module_U_Current_measurement_circuit#1.1 U8_U_Servos_controller_U_Servo_control_module_U_Current_measurement_circuit#1.5)
NetC24_U_Servos_controller_U_Servo_control_module#2_2: U_Servos_controller/U_Servo_control_module (C24_U_Servos_controller_U_Servo_control_module#2.2 C25_U_Servos_controller_U_Servo_control_module#2.1 D8_U_Servos_controller_U_Servo_control_module#2.2 P20_U_Servos_controller_U_Servo_control_module#2.2), U_Servos_controller/U_Servo_control_module/U_Current_measurement_circuit (R80_U_Servos_controller_U_Servo_control_module_U_Current_measurement_circuit#2.1 U8_U_Servos_controller_U_Servo_control_module_U_Current_measurement_circuit#2.5)
NetC24_U_Servos_controller_U_Servo_control_module#3_2: U_Servos_controller/U_Servo_control_module (C24_U_Servos_controller_U_Servo_control_module#3.2 C25_U_Servos_controller_U_Servo_control_module#3.1 D8_U_Servos_controller_U_Servo_control_module#3.2 P20_U_Servos_controller_U_Servo_control_module#3.2), U_Servos_controller/U_Servo_control_module/U_Current_measurement_circuit (R80_U_Servos_controller_U_Servo_control_module_U_Current_measurement_circuit#3.1 U8_U_Servos_controller_U_Servo_control_module_U_Current_measurement_circuit#3.5)
NetC24_U_Servos_controller_U_Servo_control_module#4_2: U_Servos_controller/U_Servo_control_module (C24_U_Servos_controller_U_Servo_control_module#4.2 C25_U_Servos_controller_U_Servo_control_module#4.1 D8_U_Servos_controller_U_Servo_control_module#4.2 P20_U_Servos_controller_U_Servo_control_module#4.2), U_Servos_controller/U_Servo_control_module/U_Current_measurement_circuit (R80_U_Servos_controller_U_Servo_control_module_U_Current_measurement_circuit#4.1 U8_U_Servos_controller_U_Servo_control_module_U_Current_measurement_circuit#4.5)
NetC24_U_Servos_controller_U_Servo_control_module#5_2: U_Servos_controller/U_Servo_control_module (C24_U_Servos_controller_U_Servo_control_module#5.2 C25_U_Servos_controller_U_Servo_control_module#5.1 D8_U_Servos_controller_U_Servo_control_module#5.2 P20_U_Servos_controller_U_Servo_control_module#5.2), U_Servos_controller/U_Servo_control_module/U_Current_measurement_circuit (R80_U_Servos_controller_U_Servo_control_module_U_Current_measurement_circuit#5.1 U8_U_Servos_controller_U_Servo_control_module_U_Current_measurement_circuit#5.5)
NetC24_U_Servos_controller_U_Servo_control_module#6_2: U_Servos_controller/U_Servo_control_module (C24_U_Servos_controller_U_Servo_control_module#6.2 C25_U_Servos_controller_U_Servo_control_module#6.1 D8_U_Servos_controller_U_Servo_control_module#6.2 P20_U_Servos_controller_U_Servo_control_module#6.2), U_Servos_controller/U_Servo_control_module/U_Current_measurement_circuit (R80_U_Servos_controller_U_Servo_control_module_U_Current_measurement_circuit#6.1 U8_U_Servos_controller_U_Servo_control_module_U_Current_measurement_circuit#6.5)
NetC24_U_Servos_controller_U_Servo_control_module#7_2: U_Servos_controller/U_Servo_control_module (C24_U_Servos_controller_U_Servo_control_module#7.2 C25_U_Servos_controller_U_Servo_control_module#7.1 D8_U_Servos_controller_U_Servo_control_module#7.2 P20_U_Servos_controller_U_Servo_control_module#7.2), U_Servos_controller/U_Servo_control_module/U_Current_measurement_circuit (R80_U_Servos_controller_U_Servo_control_module_U_Current_measurement_circuit#7.1 U8_U_Servos_controller_U_Servo_control_module_U_Current_measurement_circuit#7.5)
NetC24_U_Servos_controller_U_Servo_control_module#8_2: U_Servos_controller/U_Servo_control_module (C24_U_Servos_controller_U_Servo_control_module#8.2 C25_U_Servos_controller_U_Servo_control_module#8.1 D8_U_Servos_controller_U_Servo_control_module#8.2 P20_U_Servos_controller_U_Servo_control_module#8.2), U_Servos_controller/U_Servo_control_module/U_Current_measurement_circuit (R80_U_Servos_controller_U_Servo_control_module_U_Current_measurement_circuit#8.1 U8_U_Servos_controller_U_Servo_control_module_U_Current_measurement_circuit#8.5)
NetC24_U_Servos_controller_U_Servo_control_module#9_2: U_Servos_controller/U_Servo_control_module (C24_U_Servos_controller_U_Servo_control_module#9.2 C25_U_Servos_controller_U_Servo_control_module#9.1 D8_U_Servos_controller_U_Servo_control_module#9.2 P20_U_Servos_controller_U_Servo_control_module#9.2), U_Servos_controller/U_Servo_control_module/U_Current_measurement_circuit (R80_U_Servos_controller_U_Servo_control_module_U_Current_measurement_circuit#9.1 U8_U_Servos_controller_U_Servo_control_module_U_Current_measurement_circuit#9.5)
NetC24_U_Servos_controller_U_Servo_control_module#10_2: U_Servos_controller/U_Servo_control_module (C24_U_Servos_controller_U_Servo_control_module#10.2 C25_U_Servos_controller_U_Servo_control_module#10.1 D8_U_Servos_controller_U_Servo_control_module#10.2 P20_U_Servos_controller_U_Servo_control_module#10.2), U_Servos_controller/U_Servo_control_module/U_Current_measurement_circuit (R80_U_Servos_controller_U_Servo_control_module_U_Current_measurement_circuit#10.1 U8_U_Servos_controller_U_Servo_control_module_U_Current_measurement_circuit#10.5)
NetC24_U_Servos_controller_U_Servo_control_module#11_2: U_Servos_controller/U_Servo_control_module (C24_U_Servos_controller_U_Servo_control_module#11.2 C25_U_Servos_controller_U_Servo_control_module#11.1 D8_U_Servos_controller_U_Servo_control_module#11.2 P20_U_Servos_controller_U_Servo_control_module#11.2), U_Servos_controller/U_Servo_control_module/U_Current_measurement_circuit (R80_U_Servos_controller_U_Servo_control_module_U_Current_measurement_circuit#11.1 U8_U_Servos_controller_U_Servo_control_module_U_Current_measurement_circuit#11.5)
NetC24_U_Servos_controller_U_Servo_control_module#12_2: U_Servos_controller/U_Servo_control_module (C24_U_Servos_controller_U_Servo_control_module#12.2 C25_U_Servos_controller_U_Servo_control_module#12.1 D8_U_Servos_controller_U_Servo_control_module#12.2 P20_U_Servos_controller_U_Servo_control_module#12.2), U_Servos_controller/U_Servo_control_module/U_Current_measurement_circuit (R80_U_Servos_controller_U_Servo_control_module_U_Current_measurement_circuit#12.1 U8_U_Servos_controller_U_Servo_control_module_U_Current_measurement_circuit#12.5)
NetC24_U_Servos_controller_U_Servo_control_module#13_2: U_Servos_controller/U_Servo_control_module (C24_U_Servos_controller_U_Servo_control_module#13.2 C25_U_Servos_controller_U_Servo_control_module#13.1 D8_U_Servos_controller_U_Servo_control_module#13.2 P20_U_Servos_controller_U_Servo_control_module#13.2), U_Servos_controller/U_Servo_control_module/U_Current_measurement_circuit (R80_U_Servos_controller_U_Servo_control_module_U_Current_measurement_circuit#13.1 U8_U_Servos_controller_U_Servo_control_module_U_Current_measurement_circuit#13.5)
NetC24_U_Servos_controller_U_Servo_control_module#14_2: U_Servos_controller/U_Servo_control_module (C24_U_Servos_controller_U_Servo_control_module#14.2 C25_U_Servos_controller_U_Servo_control_module#14.1 D8_U_Servos_controller_U_Servo_control_module#14.2 P20_U_Servos_controller_U_Servo_control_module#14.2), U_Servos_controller/U_Servo_control_module/U_Current_measurement_circuit (R80_U_Servos_controller_U_Servo_control_module_U_Current_measurement_circuit#14.1 U8_U_Servos_controller_U_Servo_control_module_U_Current_measurement_circuit#14.5)
NetC24_U_Servos_controller_U_Servo_control_module#15_2: U_Servos_controller/U_Servo_control_module (C24_U_Servos_controller_U_Servo_control_module#15.2 C25_U_Servos_controller_U_Servo_control_module#15.1 D8_U_Servos_controller_U_Servo_control_module#15.2 P20_U_Servos_controller_U_Servo_control_module#15.2), U_Servos_controller/U_Servo_control_module/U_Current_measurement_circuit (R80_U_Servos_controller_U_Servo_control_module_U_Current_measurement_circuit#15.1 U8_U_Servos_controller_U_Servo_control_module_U_Current_measurement_circuit#15.5)
NetC24_U_Servos_controller_U_Servo_control_module#16_2: U_Servos_controller/U_Servo_control_module (C24_U_Servos_controller_U_Servo_control_module#16.2 C25_U_Servos_controller_U_Servo_control_module#16.1 D8_U_Servos_controller_U_Servo_control_module#16.2 P20_U_Servos_controller_U_Servo_control_module#16.2), U_Servos_controller/U_Servo_control_module/U_Current_measurement_circuit (R80_U_Servos_controller_U_Servo_control_module_U_Current_measurement_circuit#16.1 U8_U_Servos_controller_U_Servo_control_module_U_Current_measurement_circuit#16.5)
NetC24_U_Servos_controller_U_Servo_control_module#17_2: U_Servos_controller/U_Servo_control_module (C24_U_Servos_controller_U_Servo_control_module#17.2 C25_U_Servos_controller_U_Servo_control_module#17.1 D8_U_Servos_controller_U_Servo_control_module#17.2 P20_U_Servos_controller_U_Servo_control_module#17.2), U_Servos_controller/U_Servo_control_module/U_Current_measurement_circuit (R80_U_Servos_controller_U_Servo_control_module_U_Current_measurement_circuit#17.1 U8_U_Servos_controller_U_Servo_control_module_U_Current_measurement_circuit#17.5)
NetC24_U_Servos_controller_U_Servo_control_module#18_2: U_Servos_controller/U_Servo_control_module (C24_U_Servos_controller_U_Servo_control_module#18.2 C25_U_Servos_controller_U_Servo_control_module#18.1 D8_U_Servos_controller_U_Servo_control_module#18.2 P20_U_Servos_controller_U_Servo_control_module#18.2), U_Servos_controller/U_Servo_control_module/U_Current_measurement_circuit (R80_U_Servos_controller_U_Servo_control_module_U_Current_measurement_circuit#18.1 U8_U_Servos_controller_U_Servo_control_module_U_Current_measurement_circuit#18.5)
NetP1_1: Elkapod_power_supply_controller_module (P1.1), U_Current_measurement_circuit (R80_U_Current_measurement_circuit#2.2 U8_U_Current_measurement_circuit#2.4)
NetP13_1: Elkapod_power_supply_controller_module (P13.1), U_Current_measurement_circuit (R80_U_Current_measurement_circuit#1.2 U8_U_Current_measurement_circuit#1.4)
OC1: Elkapod_power_supply_controller_module (CN1.13), Logic_controller (U4.4)
OC2: Elkapod_power_supply_controller_module (CN1.15), Logic_controller (U4.6)
OC3: Elkapod_power_supply_controller_module (CN1.17), Logic_controller (U4.8)
OC4: Elkapod_power_supply_controller_module (CN1.19), Logic_controller (U4.10)
OC5: Elkapod_power_supply_controller_module (CN1.21), Logic_controller (U5.2)
OPTIONAL: Elkapod_power_supply_controller_module (CN1.22), Logic_controller (U3.114)
PWM1: Elkapod_power_supply_controller_module (P15.1), U_Servos_controller/U_Servo_control_module (Q2_U_Servos_controller_U_Servo_control_module#7.2 R6_U_Servos_controller_U_Servo_control_module#7.1)
PWM2: Elkapod_power_supply_controller_module (P15.2), U_Servos_controller/U_Servo_control_module (Q2_U_Servos_controller_U_Servo_control_module#8.2 R6_U_Servos_controller_U_Servo_control_module#8.1)
PWM3: Elkapod_power_supply_controller_module (P15.3), U_Servos_controller/U_Servo_control_module (Q2_U_Servos_controller_U_Servo_control_module#9.2 R6_U_Servos_controller_U_Servo_control_module#9.1)
PWM4: Elkapod_power_supply_controller_module (P15.4), U_Servos_controller/U_Servo_control_module (Q2_U_Servos_controller_U_Servo_control_module#10.2 R6_U_Servos_controller_U_Servo_control_module#10.1)
PWM5: Elkapod_power_supply_controller_module (P15.5), U_Servos_controller/U_Servo_control_module (Q2_U_Servos_controller_U_Servo_control_module#11.2 R6_U_Servos_controller_U_Servo_control_module#11.1)
PWM6: Elkapod_power_supply_controller_module (P15.6), U_Servos_controller/U_Servo_control_module (Q2_U_Servos_controller_U_Servo_control_module#12.2 R6_U_Servos_controller_U_Servo_control_module#12.1)
PWM7: Elkapod_power_supply_controller_module (P15.7), U_Servos_controller/U_Servo_control_module (Q2_U_Servos_controller_U_Servo_control_module#13.2 R6_U_Servos_controller_U_Servo_control_module#13.1)
PWM8: Elkapod_power_supply_controller_module (P15.8), U_Servos_controller/U_Servo_control_module (Q2_U_Servos_controller_U_Servo_control_module#14.2 R6_U_Servos_controller_U_Servo_control_module#14.1)
PWM9: Elkapod_power_supply_controller_module (P15.9), U_Servos_controller/U_Servo_control_module (Q2_U_Servos_controller_U_Servo_control_module#15.2 R6_U_Servos_controller_U_Servo_control_module#15.1)
PWM10: Elkapod_power_supply_controller_module (P15.10), U_Servos_controller/U_Servo_control_module (Q2_U_Servos_controller_U_Servo_control_module#16.2 R6_U_Servos_controller_U_Servo_control_module#16.1)
PWM11: Elkapod_power_supply_controller_module (P15.11), U_Servos_controller/U_Servo_control_module (Q2_U_Servos_controller_U_Servo_control_module#17.2 R6_U_Servos_controller_U_Servo_control_module#17.1)
PWM12: Elkapod_power_supply_controller_module (P15.12), U_Servos_controller/U_Servo_control_module (Q2_U_Servos_controller_U_Servo_control_module#18.2 R6_U_Servos_controller_U_Servo_control_module#18.1)
PWM13: Elkapod_power_supply_controller_module (P15.13), U_Servos_controller/U_Servo_control_module (Q2_U_Servos_controller_U_Servo_control_module#1.2 R6_U_Servos_controller_U_Servo_control_module#1.1)
PWM14: Elkapod_power_supply_controller_module (P15.14), U_Servos_controller/U_Servo_control_module (Q2_U_Servos_controller_U_Servo_control_module#2.2 R6_U_Servos_controller_U_Servo_control_module#2.1)
PWM15: Elkapod_power_supply_controller_module (P15.15), U_Servos_controller/U_Servo_control_module (Q2_U_Servos_controller_U_Servo_control_module#3.2 R6_U_Servos_controller_U_Servo_control_module#3.1)
PWM16: Elkapod_power_supply_controller_module (P15.16), U_Servos_controller/U_Servo_control_module (Q2_U_Servos_controller_U_Servo_control_module#4.2 R6_U_Servos_controller_U_Servo_control_module#4.1)
PWM17: Elkapod_power_supply_controller_module (P15.17), U_Servos_controller/U_Servo_control_module (Q2_U_Servos_controller_U_Servo_control_module#5.2 R6_U_Servos_controller_U_Servo_control_module#5.1)
PWM18: Elkapod_power_supply_controller_module (P15.18), U_Servos_controller/U_Servo_control_module (Q2_U_Servos_controller_U_Servo_control_module#6.2 R6_U_Servos_controller_U_Servo_control_module#6.1)